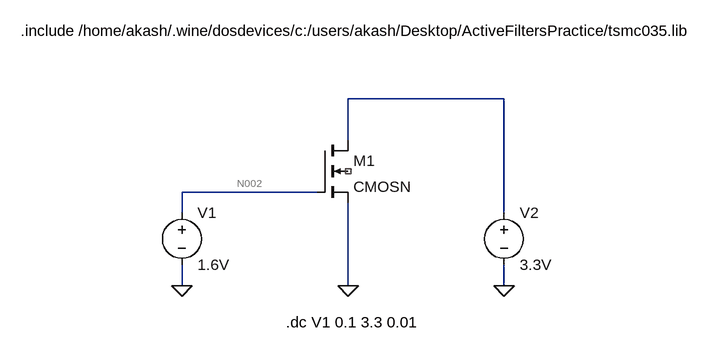
[diagram p0: schematic TSMC250nm.asc]
TSMC250nm.asc, the LTspice schematic file:
Version 4
SHEET 1 1260 4660
WIRE 640 64 400 64
WIRE 400 128 400 64
WIRE 352 208 144 208
WIRE 144 240 144 208
WIRE 640 240 640 64
WIRE 144 352 144 320
WIRE 400 352 400 224
WIRE 640 352 640 320
FLAG 144 352 0
FLAG 640 352 0
FLAG 400 352 0
SYMBOL voltage 144 224 R0
SYMATTR InstName V1
SYMATTR Value 1.6V
SYMBOL voltage 640 224 R0
SYMATTR InstName V2
SYMATTR Value 3.3V
SYMBOL nmos4 352 128 R0
SYMATTR InstName M1
SYMATTR Value CMOSN
SYMATTR Value2 l=0.5u w=50u
TEXT 304 408 Left 2 !.dc V1 0.1 3.3 0.01
TEXT -104 -40 Left 2 !.include /home/akash/.wine/dosdevices/c:/users/akash/Desktop/ActiveFiltersPractice/tsmc035.lib

The netlist it stands for:
* TSMC250nm.asc
V1 N002 0 1.6V
V2 N001 0 3.3V
M1 N001 N002 0 NC_01 CMOSN l=0.5u w=50u
.model NMOS NMOS
.model PMOS PMOS
.lib standard.mos
.dc V1 0.1 3.3 0.01
.include /home/akash/.wine/dosdevices/c:/users/akash/Desktop/ActiveFiltersPractice/tsmc035.lib
.backanno
.end

* Results of the author's LTspice run, read from the files saved beside the schematic
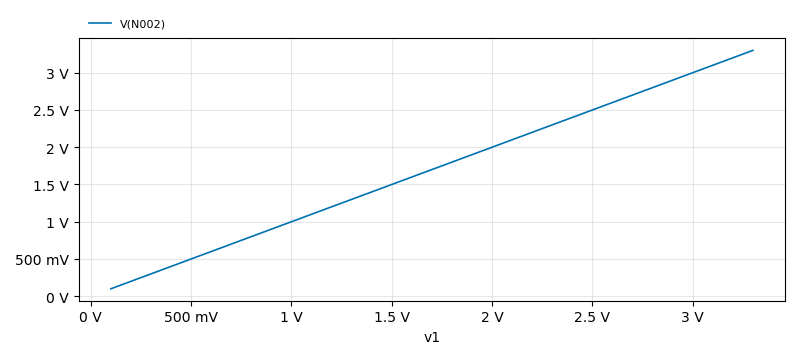
[diagram p1: DC transfer characteristic of TSMC250nm.asc, plotted from the saved traces]
* DC transfer characteristic, 1 run:
*   V(N002): 100 mV at v1=100 mV, 3.3 V at v1=3.3 V, min 100 mV, max 3.3 V